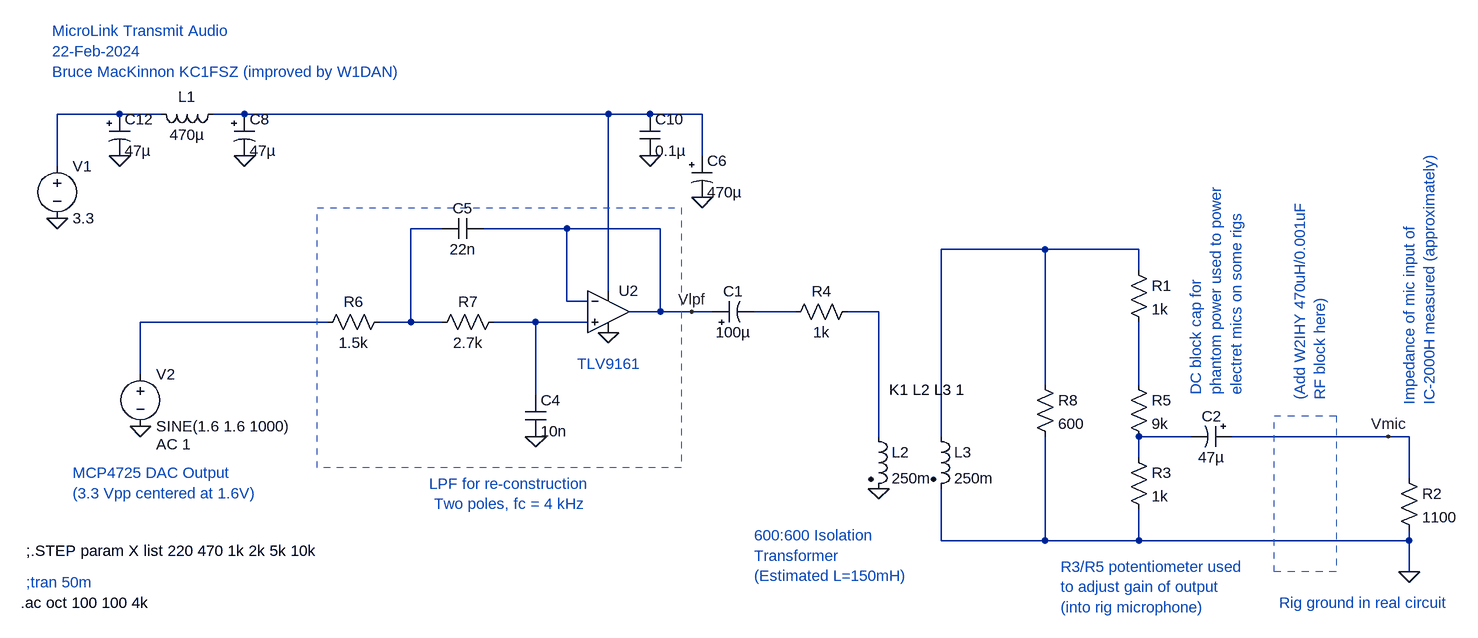
[diagram p0: schematic tx-audio-1.asc]
tx-audio-1.asc, the LTspice schematic file:
Version 4
SHEET 1 2048 680
WIRE -336 -208 -432 -208
WIRE -272 -208 -336 -208
WIRE -144 -208 -192 -208
WIRE 416 -208 -144 -208
WIRE 480 -208 416 -208
WIRE 560 -208 480 -208
WIRE 560 -144 560 -208
WIRE -432 -128 -432 -208
WIRE 160 -32 112 -32
WIRE 352 -32 224 -32
WIRE 496 -32 352 -32
WIRE 1088 0 928 0
WIRE 1232 0 1088 0
WIRE 1232 32 1232 0
WIRE 416 64 416 -208
WIRE 352 80 352 -32
WIRE 384 80 352 80
WIRE 496 96 496 -32
WIRE 496 96 448 96
WIRE 544 96 496 96
WIRE 576 96 544 96
WIRE 704 96 640 96
WIRE 832 96 784 96
WIRE -16 112 -304 112
WIRE 112 112 112 -32
WIRE 112 112 64 112
WIRE 160 112 112 112
WIRE 304 112 240 112
WIRE 384 112 304 112
WIRE -304 192 -304 112
WIRE 1088 208 1088 0
WIRE 1232 208 1232 112
WIRE 304 224 304 112
WIRE 832 288 832 96
WIRE 928 288 928 0
WIRE 1312 288 1232 288
WIRE 1616 288 1376 288
WIRE 1648 288 1616 288
WIRE 1232 320 1232 288
WIRE 1648 352 1648 288
WIRE 928 448 928 368
WIRE 1088 448 1088 288
WIRE 1088 448 928 448
WIRE 1232 448 1232 400
WIRE 1232 448 1088 448
WIRE 1648 448 1648 432
WIRE 1648 448 1232 448
WIRE 1648 496 1648 448
FLAG 304 288 0
FLAG 416 128 0
FLAG 560 -80 0
FLAG -432 -48 0
FLAG -304 272 0
FLAG 480 -144 0
FLAG -336 -144 0
FLAG -144 -144 0
FLAG 832 368 0
FLAG 1616 288 Vmic
FLAG 1648 496 0
FLAG 544 96 Vlpf
SYMBOL OpAmps\\UniversalOpAmp 416 96 R0
SYMATTR InstName U2
SYMBOL res 80 96 R90
WINDOW 0 0 56 VBottom 2
WINDOW 3 32 56 VTop 2
SYMATTR InstName R6
SYMATTR Value 1.5k
SYMBOL res 256 96 R90
WINDOW 0 0 56 VBottom 2
WINDOW 3 32 56 VTop 2
SYMATTR InstName R7
SYMATTR Value 2.7k
SYMBOL cap 288 224 R0
SYMATTR InstName C4
SYMATTR Value 10n
SYMBOL cap 224 -48 R90
WINDOW 0 0 32 VBottom 2
WINDOW 3 32 32 VTop 2
SYMATTR InstName C5
SYMATTR Value 22n
SYMBOL polcap 544 -144 R0
SYMATTR InstName C6
SYMATTR Value 470µ
SYMBOL voltage -432 -144 R0
WINDOW 123 0 0 Left 0
WINDOW 39 0 0 Left 0
SYMATTR InstName V1
SYMATTR Value 3.3
SYMBOL voltage -304 176 R0
WINDOW 123 24 124 Left 2
WINDOW 39 24 152 Left 2
SYMATTR Value2 AC 1
SYMATTR InstName V2
SYMATTR Value SINE(1.6 1.6 1000)
SYMBOL cap 464 -208 R0
SYMATTR InstName C10
SYMATTR Value 0.1µ
SYMBOL polcap -160 -208 R0
SYMATTR InstName C8
SYMATTR Value 47µ
SYMBOL polcap -352 -208 R0
SYMATTR InstName C12
SYMATTR Value 47µ
SYMBOL ind -176 -224 R90
WINDOW 0 5 56 VBottom 2
WINDOW 3 32 56 VTop 2
SYMATTR InstName L1
SYMATTR Value 470µ
SYMBOL polcap 576 112 R270
WINDOW 0 32 32 VTop 2
WINDOW 3 0 32 VBottom 2
SYMATTR InstName C1
SYMATTR Value 100µ
SYMBOL ind2 816 272 R0
SYMATTR InstName L2
SYMATTR Value 250m
SYMATTR Type ind
SYMBOL ind2 912 272 R0
SYMATTR InstName L3
SYMATTR Value 250m
SYMATTR Type ind
SYMBOL res 1632 336 R0
SYMATTR InstName R2
SYMATTR Value 1100
SYMBOL res 1216 16 R0
SYMATTR InstName R1
SYMATTR Value 1k
SYMBOL res 1216 304 R0
SYMATTR InstName R3
SYMATTR Value 1k
SYMBOL polcap 1376 272 R90
WINDOW 0 0 32 VBottom 2
WINDOW 3 32 32 VTop 2
SYMATTR InstName C2
SYMATTR Value 47µ
SYMBOL res 800 80 R90
WINDOW 0 0 56 VBottom 2
WINDOW 3 32 56 VTop 2
SYMATTR InstName R4
SYMATTR Value 1k
SYMBOL res 1216 192 R0
SYMATTR InstName R5
SYMATTR Value 9k
SYMBOL res 1072 192 R0
SYMATTR InstName R8
SYMATTR Value 600
TEXT 264 376 Center 2 ;LPF for re-construction\nTwo poles, fc = 4 kHz
TEXT -480 512 Left 2 ;;tran 50m
TEXT -488 544 Left 2 !.ac oct 100 100 4k
TEXT 368 176 Left 2 ;TLV9161
TEXT -480 464 Left 2 !;.STEP param X list 220 470 1k 2k 5k 10k
TEXT -440 -336 Left 2 ;MicroLink Transmit Audio\n22-Feb-2024\nBruce MacKinnon KC1FSZ (improved by W1DAN)
TEXT -408 344 Left 2 ;MCP4725 DAC Output\n(3.3 Vpp centered at 1.6V)
TEXT 848 216 Left 2 !K1 L2 L3 1
TEXT 1112 488 Left 2 ;R3/R5 potentiometer used \nto adjust gain of output \n(into rig microphone)
TEXT 1320 224 VLeft 2 ;DC block cap for \nphantom power used to power\nelectret mics on some rigs
TEXT 1448 544 Left 2 ;Rig ground in real circuit
TEXT 1480 232 VLeft 2 ;(Add W2IHY 470uH/0.001uF \nRF block here)
TEXT 640 440 Left 2 ;600:600 Isolation \nTransformer \n(Estimated L=150mH)
TEXT 1648 240 VLeft 2 ;Impedance of mic input of \nIC-2000H measured (approximately)
RECTANGLE Normal 528 336 -32 -64 2
RECTANGLE Normal 1536 496 1440 256 2

The netlist it stands for:
* tx-audio-1.asc
XU2 N008 Vlpf N002 0 Vlpf level1 Avol=1Meg GBW=10Meg Vos=0 En=0 Enk=0 In=0 Ink=0 Rin=500Meg  ; pins In+ In- V+ V- OUT
R6 N003 N007 1.5k
R7 N008 N003 2.7k
C4 N008 0 10n
C5 Vlpf N003 22n
C6 N002 0 470µ
V1 N001 0 3.3
V2 N007 0 SINE(1.6 1.6 1000) AC 1
C10 N002 0 0.1µ
C8 N002 0 47µ
C12 N001 0 47µ
L1 N002 N001 470µ
C1 Vlpf N005 100µ
L2 N006 0 250m
L3 N004 0 250m
R2 Vmic 0 1100
R1 N004 N009 1k
R3 N010 0 1k
C2 Vmic N010 47µ
R4 N006 N005 1k
R5 N009 N010 9k
R8 N004 0 600
* LPF for re-construction
* Two poles, fc = 4 kHz
* ;tran 50m
.ac oct 100 100 4k
* TLV9161
;.STEP param X list 220 470 1k 2k 5k 10k
* MicroLink Transmit Audio
* 22-Feb-2024
* Bruce MacKinnon KC1FSZ (improved by W1DAN)
* MCP4725 DAC Output
* (3.3 Vpp centered at 1.6V)
K1 L2 L3 1
* R3/R5 potentiometer used
* to adjust gain of output
* (into rig microphone)
* DC block cap for
* phantom power used to power
* electret mics on some rigs
* Rig ground in real circuit
* (Add W2IHY 470uH/0.001uF
* RF block here)
* 600:600 Isolation
* Transformer
* (Estimated L=150mH)
* Impedance of mic input of
* IC-2000H measured (approximately)
.lib UniversalOpAmp1.lib
.backanno
.end